# Altium schematic sheet [05] - MECHANICAL.SchDoc
size A4; Date: 07/05/2016; CheckedBy: Javier Guillemat; Author: Javier Jiménez; CompanyName: Guilletronic; Organization: Guilletronic; Address1: Calle del Cel Nº14; Address2: Las Colinas; Address3: 08818 Olivella; DocumentNumber: 5; Revision: A; SheetNumber: 5; SheetTotal: 6
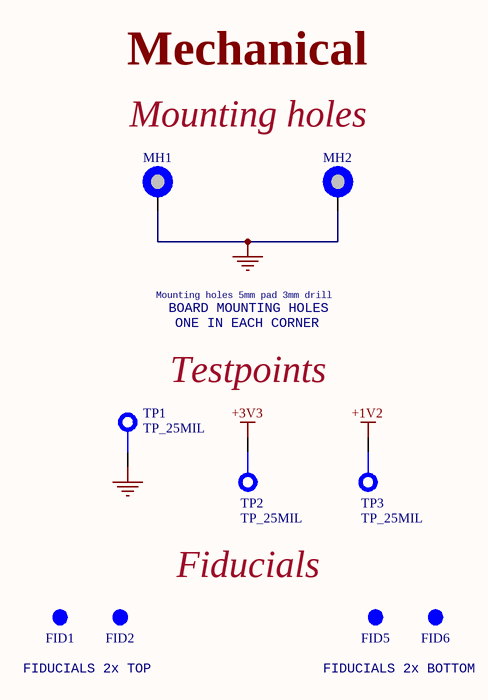
[diagram p0: [05] - MECHANICAL.SchDoc]

## Parts
FID1  FID_40x120  [FID_40x120]  (value not drawn)  (no BOM)
FID2  FID_40x120  [FID_40x120]  (value not drawn)  (no BOM)
FID5  FID_40x120  [FID_40x120]  (value not drawn)  (no BOM)
FID6  FID_40x120  [FID_40x120]  (value not drawn)  (no BOM)
MH1  Mounting Hole  [MH3]  (value not drawn)  (no BOM)
MH2  Mounting Hole  [MH3]  (value not drawn)  (no BOM)
TP1  TP_25MIL  [TP_25MIL]  (no BOM)
TP2  TP_25MIL  [TP_25MIL]  (no BOM)
TP3  TP_25MIL  [TP_25MIL]  (no BOM)

## Nets
+1V2: TP3.1
+3V3: TP2.1
GND: MH1.1 MH2.1 TP1.1

## Notes on the sheet
- Mechanical
- Mounting holes
- Mounting holes 5mm pad 3mm drill
- BOARD MOUNTING HOLES
- ONE IN EACH CORNER
- Testpoints
- Fiducials
- FIDUCIALS 2x TOP
- FIDUCIALS 2x BOTTOM
- Title
- Size:
- Date:
- Created:
- A4
- Number:
- Time:
- Modified:
- Revision:
- Sheet
- of
- Author:
- File:

## Library data of the parts
FID1 FID2 FID5 FID6 = FID_40x120: Fiducial
MH1 MH2 = MH5 Mounting Hole
TP1-TP3 = TP_25MIL: Test Point 25mil